# Altium schematic sheet Parallel_CS_Top.SchDoc
size A4
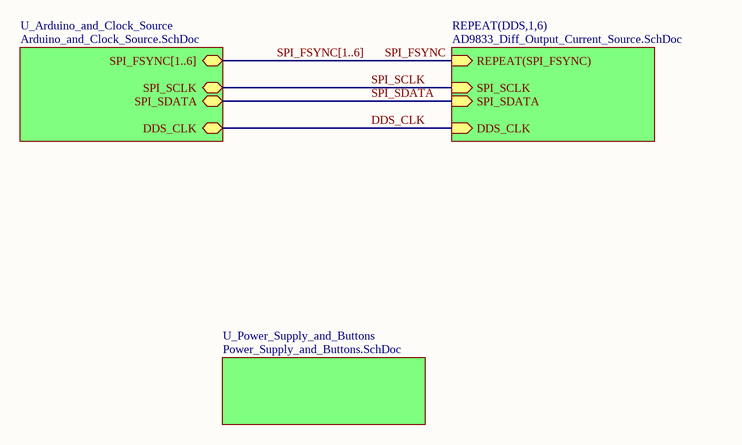
[diagram p0: Parallel_CS_Top.SchDoc]

## Sub-sheets
REPEAT(DDS,1,6) = AD9833_Diff_Output_Current_Source.SchDoc: REPEAT(SPI_FSYNC) (in), SPI_SCLK (in), SPI_SDATA (in), DDS_CLK (in)
U_Arduino_and_Clock_Source = Arduino_and_Clock_Source.SchDoc: DDS_CLK (bidir), SPI_SDATA (bidir), SPI_SCLK (bidir), SPI_FSYNC[1..6] (bidir)
U_Power_Supply_and_Buttons = Power_Supply_and_Buttons.SchDoc: no entries

## Nets
DDS_CLK: sheet REPEAT(DDS,1,6)/DDS_CLK, sheet U_Arduino_and_Clock_Source/DDS_CLK
SPI_FSYNC: sheet REPEAT(DDS,1,6)/REPEAT(SPI_FSYNC)
SPI_SCLK: sheet REPEAT(DDS,1,6)/SPI_SCLK, sheet U_Arduino_and_Clock_Source/SPI_SCLK
SPI_SDATA: sheet REPEAT(DDS,1,6)/SPI_SDATA, sheet U_Arduino_and_Clock_Source/SPI_SDATA

## Buses and harness runs
bus SPI_FSYNC[1..6] = sheet U_Arduino_and_Clock_Source/SPI_FSYNC[1..6]